# EAGLE design msp430g2432 uC Module (EAGLE 6.3)
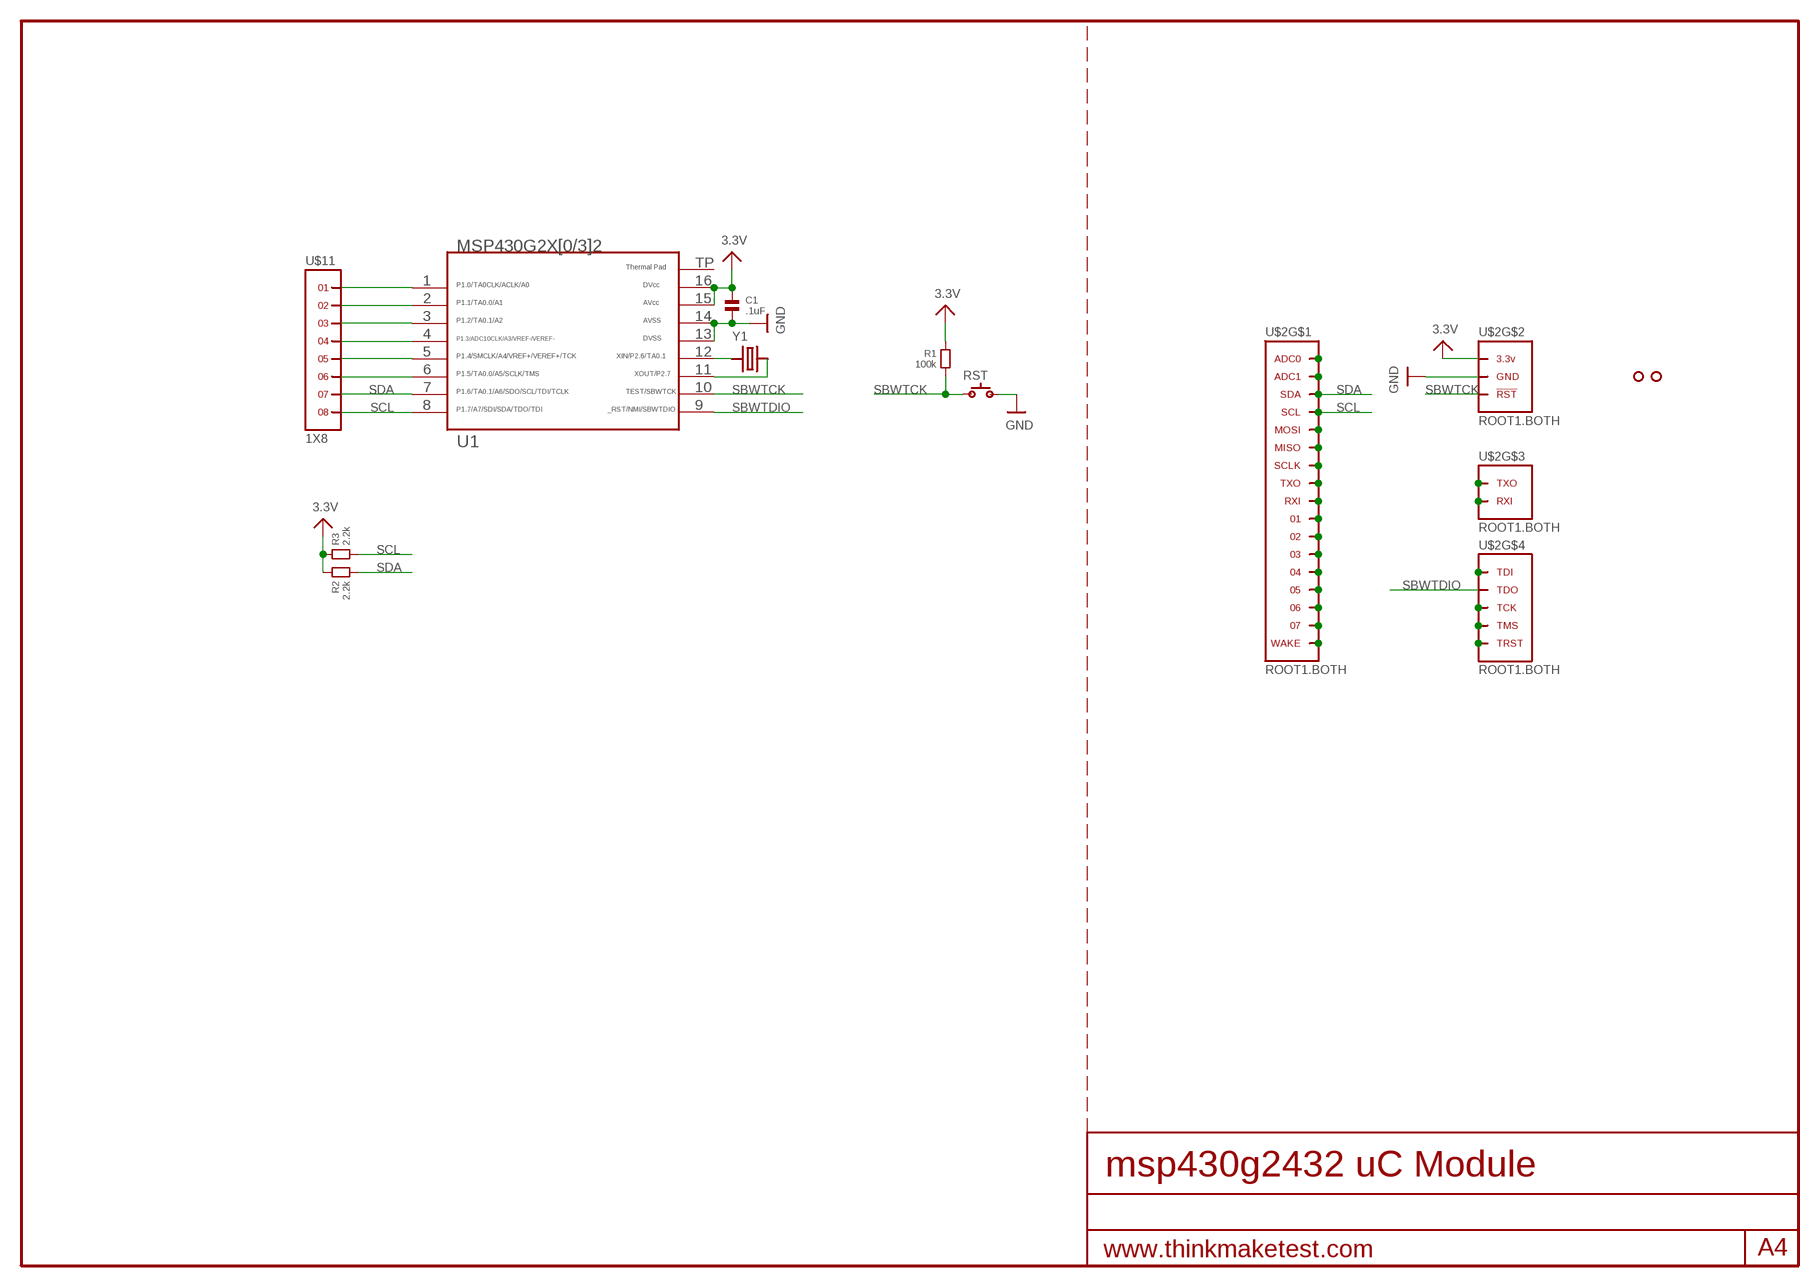
[diagram p0: schematic, sheet 1]

## Parts
C1  .1uF  CAPACITOR.0603  [0603]
R1  100k  RESISTOR.0603  [0603]
R2  2.2k  RESISTOR.0603  [0603]
R3  2.2k  RESISTOR.0603  [0603]
RST  SPST.B3U-3000P(M)-B  [B3U-3000P(M)-B]
U1  G2432.QFN16  G2X[0/3]2---RSA16  [RSA16]
U$2  ROOT1.BOTH  [ROOT1.BOTH]
U$3  HOLE.2MM  [2MM]
U$4  HOLE.2MM  [2MM]
U$11  1X8  [1X8]
Y1  CRYSTAL.ABS07  [ABS07]

## Nets
3.3V: C1.1 R1.1 R2.1 R3.1 U1.15 U1.16 U$2.3.3V@1(3.3V) U$2.3.3V@2(3.3V) U$2.3.3V@3(3.3V) U$2.3.3V@4(3.3V) U$2.3.3V@5(3.3V) U$2.3.3V@6(3.3V) U$2.3.3V@7(3.3V) U$2.3.3V@8(3.3V) U$2.3.3V@9(3.3V) U$2.3.3V@10(3.3V) U$2.3.3V@11(3.3V) U$2.3.3V@12(3.3V) U$2.3.3V@13(3.3V) U$2.3.3V@14(3.3V) U$2.3.3V@15(3.3V) U$2.3.3V@16(3.3V) U$2.3.3V@17(3.3V) U$2.3.3V@18(3.3V) U$2.3.3V@19(3.3V) U$2.3.3V@20(3.3V) U$2.3.3V@21(3.3V) U$2.3.3V@22(3.3V) U$2.3.3V@23(3.3V) U$2.3.3V@24(3.3V) U$2.3.3V@VIA(3.3V)
GND: C1.2 RST.1 U1.13 U1.14 U$2.GND@1(GND) U$2.GND@2(GND) U$2.GND@3(GND) U$2.GND@4(GND) U$2.GND@5(GND) U$2.GND@6(GND) U$2.GND@7(GND) U$2.GND@8(GND) U$2.GND@9(GND) U$2.GND@10(GND) U$2.GND@11(GND) U$2.GND@12(GND) U$2.GND@13(GND) U$2.GND@14(GND) U$2.GND@15(GND) U$2.GND@16(GND) U$2.GND@17(GND) U$2.GND@18(GND) U$2.GND@19(GND) U$2.GND@20(GND) U$2.GND@21(GND) U$2.GND@22(GND) U$2.GND@23(GND) U$2.GND@24(GND) U$2.GND@25(GND) U$2.GND@26(GND) U$2.GND@VIA(GND)
N$1: U$2.04 U$2.04@1 U$2.04@VIA
N$2: U$2.ADC1 U$2.ADC1@1(ADC1) U$2.ADC1@VIA(ADC1)
N$3: U1.1 U$11.1
N$4: U1.2 U$11.2
N$5: U$2.03 U$2.03@1 U$2.03@VIA
N$6: U$2.MISO U$2.MISO@1(MISO) U$2.MISO@VIA(MISO)
N$7: U$2.SCLK U$2.SCLK@1(SCLK) U$2.SCLK@VIA(SCLK)
N$8: U$2.TXO U$2.TXO@1(TXO) U$2.TXO@VIA(TXO)
N$9: U$2.RXI U$2.RXI@1(RXI) U$2.RXI@VIA(RXI)
N$10: U$2.01 U$2.01@1 U$2.01@VIA
N$11: U$2.02 U$2.02@1 U$2.02@VIA
N$12: U$2.MOSI U$2.MOSI@1(MOSI) U$2.MOSI@VIA(MOSI)
N$13: U$2.ADC0 U$2.ADC0@1(ADC0) U$2.ADC0@VIA(ADC0)
N$14: U$2.05 U$2.05@1 U$2.05@VIA
N$15: U$2.06 U$2.06@1 U$2.06@VIA
N$16: U$2.07 U$2.07@1 U$2.07@VIA
N$17: U$2.WAKE U$2.WAKE@1(WAKE) U$2.WAKE@VIA(WAKE)
N$18: U$2.TDI U$2.TDI@1(TDI) U$2.TDI@VIA(TDI)
N$19: U1.3 U$11.3
N$20: U1.4 U$11.4
N$21: U$2.TMS U$2.TMS@1(TMS) U$2.TMS@VIA(TMS)
N$22: U$2.TRST U$2.TRST@1(TRST) U$2.TRST@VIA(TRST)
N$23: U$2.RXI.DBG(RXI) U$2.RXI.DBG@1(RXI) U$2.RXI.DBG@VIA(RXI)
N$24: U$2.TXO.DBG(TXO) U$2.TXO.DBG@1(TXO) U$2.TXO.DBG@VIA(TXO)
N$26: U1.12 Y1.1
N$27: U1.11 Y1.2
N$28: U1.5 U$11.5
N$29: U1.6 U$11.6
N$31: U$2.TCK U$2.TCK@1(TCK) U$2.TCK@VIA(TCK)
SBWTCK: R1.2 RST.2 U1.10 U$2.RST(!RST) U$2.RST@1(!RST) U$2.RST@VIA(!RST)
SBWTDIO: U1.9 U$2.TDO U$2.TDO@1(TDO) U$2.TDO@VIA(TDO)
SCL: R3.2 U1.8 U$2.SCL U$2.SCL@1(SCL) U$2.SCL@VIA(SCL) U$11.8
SDA: R2.2 U1.7 U$2.SDA U$2.SDA@1(SDA) U$2.SDA@VIA(SDA) U$11.7
Unconnected: U1.TP

## Library data of the parts
C1 = .standardparts:CAPACITOR
R1-R3 = .standardparts:RESISTOR
RST = omron:SPST
U1 = TI_MSP430_v16:G2X[0/3]2---RSA16: MSP430G2X[0/3]2 MSP430G2x32, MSP430G2x02 QFN (RSA) 16 Pin Package http://focus.ti.com/docs/prod/folders/print/msp430g2432.html
U$2 = thinkmaketest:ROOT1
U$3 U$4 = .screw_holes:HOLE
U$11 = .headers(.1in):1X8
Y1 = abracon:CRYSTAL

## Board
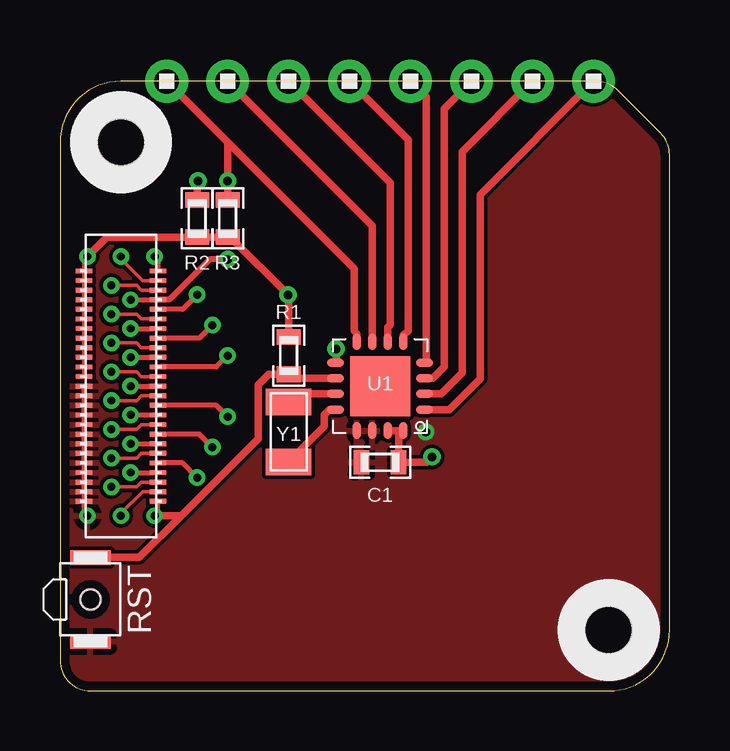
[diagram p1: board, top side]
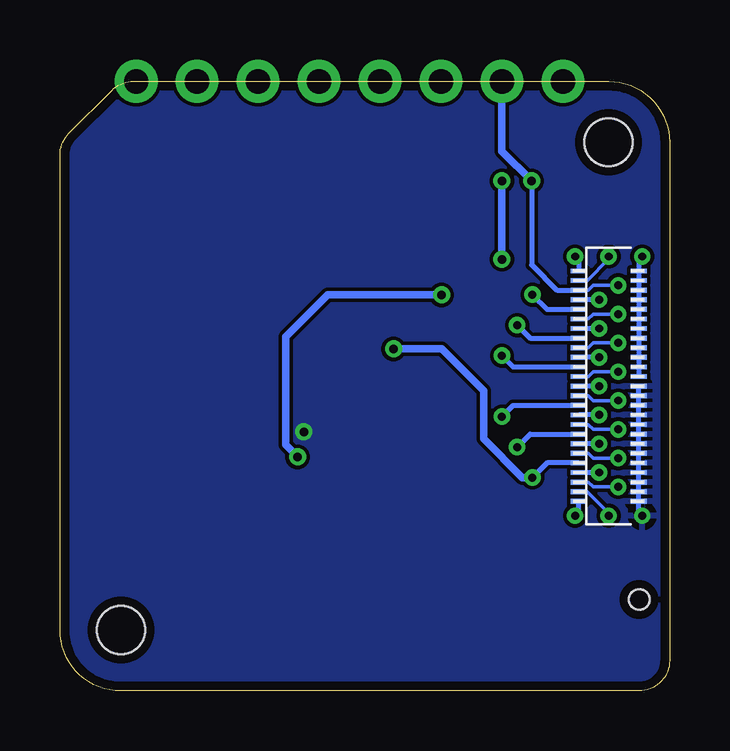
[diagram p2: board, bottom side, seen from below]

Size 25.4 x 25.4 mm. Coordinates in mm from the lower left corner, seen from the top.
Outline: 0,22.86 0,1.27 arc90 1.27,0 22.86,0 arc90 25.4,2.54 25.4,22.33 arc45 25.03,23.23 23.23,25.03 arc45 22.33,25.4 2.54,25.4 arc90 0,22.86
Copper layers (1*16): Top 0.0356mm / dielectric 1.5011mm / Bottom 0.0356mm
Design rules "default": minimum track width 6mil, minimum drill 13mil, track to track 6mil, track to pad 6mil, pad to pad 6mil, via to via 6mil, smd to smd 6mil, copper to edge 15mil, drill to drill 6mil, minimum pad ring 7mil, minimum via ring 7mil, stop-mask expansion 4mil, vias tented up to drill 16mil, thermal gap 10mil
tRestrict: 1 lines

### Footprints (pad centres in the part's own frame; a part is rotated, then mirrored left to right if it is on the bottom)
0603 = smd 0.65 x 1: 1 -0.775,0; 2 0.775,0
B3U-3000P(M)-B = smd 0.6 x 1.7: 1 -1.75,0; 2 1.75,0 | hole 0.85: 0,0
RSA16 = smd 0.7 x 0.35: 1 -1.85,0.975; 2 -1.85,0.325; 3 -1.85,-0.325; 4 -1.85,-0.975; 9 1.85,-0.975; 10 1.85,-0.325; 11 1.85,0.325; 12 1.85,0.975 | smd 0.35 x 0.7: 5 -0.975,-1.85; 6 -0.325,-1.85; 7 0.325,-1.85; 8 0.975,-1.85; 13 0.975,1.85; 14 0.325,1.85; 15 -0.325,1.85; 16 -0.975,1.85 | smd 2.5 x 2.5: TP 0,0
ROOT1.BOTH = smd 0.66 x 0.2 bottom: 01 3.795,13.9; 02 3.795,13.5; 03 3.795,13.1; 3.3V@1 1.285,17.5; 3.3V@2 1.285,17.1; 3.3V@3 1.285,16.7; 3.3V@4 1.285,16.3; 3.3V@5 1.285,15.9; 3.3V@6 1.285,15.5; 3.3V@7 1.285,15.1; 3.3V@8 1.285,14.7; 3.3V@9 1.285,14.3; 3.3V@10 1.285,13.9; 3.3V@11 1.285,13.5; 3.3V@12 1.285,13.1; 04 3.795,12.7; 05 3.795,12.3; 06 3.795,11.9; 07 3.795,11.5; ADC0 3.795,17.5; ADC1 3.795,17.1; GND@1 1.285,7.9; GND@2 1.285,8.3; GND@3 1.285,8.7; GND@4 1.285,9.1; GND@5 1.285,9.5; GND@6 1.285,9.9; GND@7 1.285,10.3; GND@8 1.285,10.7; GND@9 1.285,11.1; GND@10 1.285,11.5; GND@11 1.285,11.9; GND@12 1.285,12.3; GND@13 1.285,12.7; MISO 3.795,15.5; MOSI 3.795,15.9; RST 3.795,7.9; RXI 3.795,14.3; RXI.DBG 3.795,10.3; SCL 3.795,16.3; SCLK 3.795,15.1; SDA 3.795,16.7; TCK 3.795,9.1; TDI 3.795,9.9; TDO 3.795,9.5; TMS 3.795,8.7; TRST 3.795,8.3; TXO 3.795,14.7; TXO.DBG 3.795,10.7; WAKE 3.795,11.1 | smd 0.7 x 0.2: 01@1 4.08,13.9; 02@1 4.08,13.5; 3.3V@13 1,17.5; 3.3V@14 1,17.1; 3.3V@15 1,16.7; 3.3V@16 1,16.3; 3.3V@17 1,15.9; 3.3V@18 1,15.5; 3.3V@19 1,15.1; 3.3V@20 1,14.7; 3.3V@21 1,14.3; 3.3V@22 1,13.9; 3.3V@23 1,13.5; 3.3V@24 1,13.1; 03@1 4.08,13.1; 04@1 4.08,12.7; 05@1 4.08,12.3; 06@1 4.08,11.9; 07@1 4.08,11.5; ADC0@1 4.08,17.5; ADC1@1 4.08,17.1; GND@14 1,7.9; GND@15 1,8.3; GND@16 1,8.7; GND@17 1,9.1; GND@18 1,9.5; GND@19 1,9.9; GND@20 1,10.3; GND@21 1,10.7; GND@22 1,11.1; GND@23 1,11.5; GND@24 1,11.9; GND@25 1,12.3; GND@26 1,12.7; MISO@1 4.08,15.5; MOSI@1 4.08,15.9; RST@1 4.08,7.9; RXI.DBG@1 4.08,10.3; RXI@1 4.08,14.3; SCL@1 4.08,16.3; SCLK@1 4.08,15.1; SDA@1 4.08,16.7; TCK@1 4.08,9.1; TDI@1 4.08,9.9; TDO@1 4.08,9.5; TMS@1 4.08,8.7; TRST@1 4.08,8.3; TXO.DBG@1 4.08,10.7; TXO@1 4.08,14.7; WAKE@1 4.08,11.1 | drill 0.33 pad 0.686: 01@VIA 2.94,13.9; 02@VIA 6.985,13.97; 3.3V@VIA 1.14,18.1; 03@VIA 2.14,13.3; 04@VIA 2.94,12.7; 05@VIA 2.14,12.1; 06@VIA 6.985,11.43; 07@VIA 2.94,11.5; ADC0@VIA 3.94,18.1; ADC1@VIA 2.54,18.1; GND@VIA 1.14,7.3; MISO@VIA 2.14,15.7; MOSI@VIA 5.715,16.51; RST@VIA 3.94,7.3; RXI.DBG@VIA 2.94,10.3; RXI@VIA 2.14,14.5; SCL@VIA 2.94,16.3; SCLK@VIA 2.94,15.1; SDA@VIA 2.14,16.9; TCK@VIA 2.94,9.1; TDI@VIA 2.14,9.7; TDO@VIA 5.715,8.89; TMS@VIA 2.14,8.5; TRST@VIA 2.54,7.3; TXO.DBG@VIA 6.35,10.16; TXO@VIA 6.35,15.24; WAKE@VIA 2.14,10.9
2MM = hole 2: 0,0
1X8 = drill 1.016 pad 1.778: 1 0,0; 2 2.54,0; 3 5.08,0; 4 7.62,0; 5 10.16,0; 6 12.7,0; 7 15.24,0; 8 17.78,0
ABS07 = smd 1.1 x 1.9: 1 -1.25,0; 2 1.25,0

### Placement (x,y rotation side)
C1  13.34,9.53 180 top
R1  9.53,13.97 270 top
R2  5.71,19.68 90 top
R3  6.99,19.68 90 top
RST  1.27,3.81 90 top
U1  13.34,12.7 180 top
U$2  0,0 0 top
U$3  22.86,2.54 90 top
U$4  2.54,22.86 90 top
U$11  22.23,25.4 180 top
Y1  9.53,10.79 90 top

### Tracks (layer width: path | path; a pad name or v marks a point on that pad's centre or on a via)
3.3V  (via drill 0.36)
  Top 0.305: U1.15 U1.16 14.11,10.65 C1.1 15.28,9.53 v15.5,9.75 | U$2.3.3V@VIA 1.95,18.91 R2.1 R3.1 7.09,18.91 v9.5,16.5 9.53,16.48 R1.1
  Bottom 0.305: v9.5,16.5 14.25,16.5 16,14.75 16,10.25 v15.5,9.75
GND  (via drill 0.36)
  other vias: 15.24,10.79
  pour Bottom (rank 6): 0,0 25.4,0 25.4,25.4 0,25.4
  pour Top (rank 6): 0,0 25.4,0 25.4,25.4 0,25.4
N$3
  Top 0.305: U1.1 16.23,11.72 17.5,13 17.5,20.68 U$11.1
N$4
  Top 0.305: U1.2 15.88,12.38 16.75,13.25 16.75,22.46 U$11.2
N$19
  Top 0.305: U1.3 15.53,13.03 16,13.5 16,24.25 U$11.3
N$20
  Top 0.305: U1.4 15.25,13.74 15.25,24.75 U$11.4
N$26
  Top 0.305: U1.12 11.22,11.72 11,11.5 11,11.02 Y1.1
N$27
  Top 0.305: U1.11 9.86,12.38 Y1.2
N$28
  Top 0.305: U$11.5 14.5,22.96 14.5,15 14.31,14.81 U1.5
N$29
  Top 0.305: U1.6 13.66,15.16 13.75,15.25 13.75,21.18 U$11.6
SBWTCK
  Top 0.305: U1.10 9.7,13.03 R1.2 8.7,13.2 8.25,12.75 8.25,10.5 5.05,7.3 | 5.05,7.3 U$2.RST@VIA | RST.2 3.31,5.56 5.05,7.3
SBWTDIO  (via drill 0.36)
  Top 0.305: U1.9 11.5,13.69 v11.5,14.25
  Bottom 0.305: v11.5,14.25 9.5,14.25 7.75,12.5 7.75,10.5 6.14,8.89 U$2.TDO@VIA
SCL  (via drill 0.36)
  Top 0.254: v6.99,17.98 6.24,17.98 4.55,16.3 U$2.SCL@1
  Top 0.305: U1.8 12.36,14.89 12.25,15 12.25,17.59 6.99,22.86 | 6.99,22.86 U$11.8 | 6.99,22.86 v6.99,21.25 R3.2
  Bottom 0.305: v6.99,17.98 v6.99,21.25
SDA  (via drill 0.36)
  Top 0.305: U1.7 13.01,15.24 13,15.25 13,19.39 U$11.7 | R2.2 5.71,21.21 v5.75,21.25
  Bottom 0.203: v5.75,21.25 5.75,17.75 4.7,16.7 U$2.SDA
  Bottom 0.305: v5.75,21.25 6.99,22.48 U$11.7

### Text on the board
tDocu: P1.0 | P1.1 | P1.2 | P1.3 | P1.4 | P1.5 | P1.6 | P1.7
bDocu: Cruz Monrreal II | v1 | innovativemaker.com